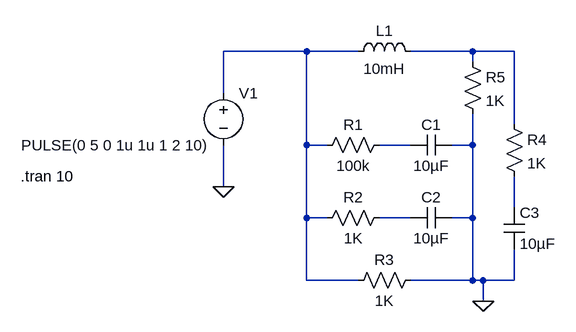
[diagram p0: schematic Circuito7.asc]
Circuito7.asc, the LTspice schematic file:
Version 4.1
SHEET 1 880 680
WIRE 48 32 -80 32
WIRE 128 32 48 32
WIRE 304 32 208 32
WIRE 368 32 304 32
WIRE 304 48 304 32
WIRE -80 96 -80 32
WIRE 368 144 368 32
WIRE 48 176 48 32
WIRE 80 176 48 176
WIRE 208 176 160 176
WIRE 304 176 304 128
WIRE 304 176 272 176
WIRE -80 240 -80 176
WIRE 368 272 368 224
WIRE 48 288 48 176
WIRE 80 288 48 288
WIRE 208 288 160 288
WIRE 304 288 304 176
WIRE 304 288 272 288
WIRE 48 384 48 288
WIRE 128 384 48 384
WIRE 304 384 304 288
WIRE 304 384 208 384
WIRE 320 384 304 384
WIRE 368 384 368 336
WIRE 368 384 320 384
WIRE 320 416 320 384
FLAG 320 416 0
FLAG -80 240 0
SYMBOL ind 112 48 R270
WINDOW 0 32 56 VTop 2
WINDOW 3 5 56 VBottom 2
SYMATTR InstName L1
SYMATTR Value 10mH
SYMBOL res 176 160 R90
WINDOW 0 0 56 VBottom 2
WINDOW 3 32 56 VTop 2
SYMATTR InstName R1
SYMATTR Value 100k
SYMBOL res 176 272 R90
WINDOW 0 0 56 VBottom 2
WINDOW 3 32 56 VTop 2
SYMATTR InstName R2
SYMATTR Value 1K
SYMBOL res 224 368 R90
WINDOW 0 0 56 VBottom 2
WINDOW 3 32 56 VTop 2
SYMATTR InstName R3
SYMATTR Value 1K
SYMBOL cap 272 160 R90
WINDOW 0 0 32 VBottom 2
WINDOW 3 32 32 VTop 2
SYMATTR InstName C1
SYMATTR Value 10µF
SYMBOL cap 208 304 R270
WINDOW 0 32 32 VTop 2
WINDOW 3 0 32 VBottom 2
SYMATTR InstName C2
SYMATTR Value 10µF
SYMBOL cap 352 272 R0
SYMATTR InstName C3
SYMATTR Value 10µF
SYMBOL res 352 128 R0
SYMATTR InstName R4
SYMATTR Value 1K
SYMBOL res 288 32 R0
SYMATTR InstName R5
SYMATTR Value 1K
SYMBOL voltage -80 80 R0
WINDOW 3 -311 96 Left 2
WINDOW 123 0 0 Left 0
WINDOW 39 0 0 Left 0
SYMATTR InstName V1
SYMATTR Value PULSE(0 5 0 1u 1u 1 2 10)
TEXT -392 224 Left 2 !.tran 10

The netlist it stands for:
* Circuito7.asc
L1 N001 N002 10mH
R1 N003 N001 100k
R2 N005 N001 1K
R3 0 N001 1K
C1 0 N003 10µF
C2 N005 0 10µF
C3 N004 0 10µF
R4 N002 N004 1K
R5 N002 0 1K
V1 N001 0 PULSE(0 5 0 1u 1u 1 2 10)
.tran 10
.backanno
.end